# Altium schematic sheet SkyPulseUAV_PowerModule.SchDoc: SkyPulseUAV_Power
size A4; Date: March 2, 2024; Author: Binhan Tian; Revision: V0.2; SheetNumber: 2; SheetTotal: 4
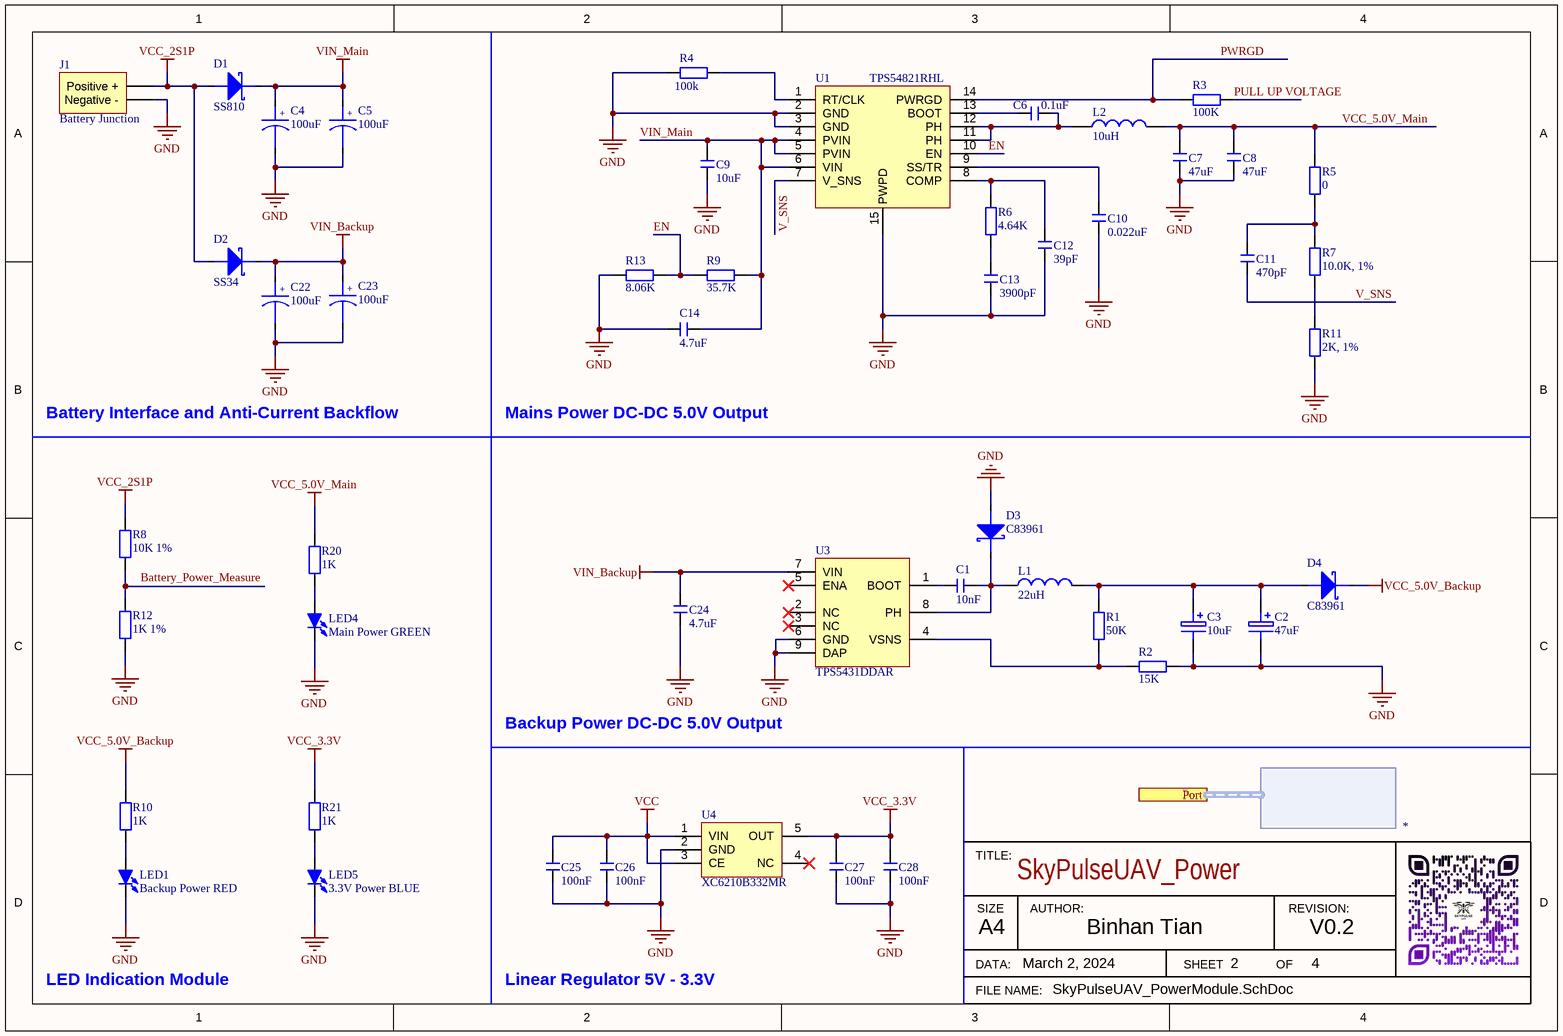
[diagram p0: SkyPulseUAV_PowerModule.SchDoc]

## Parts
C1  10nF  [C 0805_M]
C2  47uF  [CD D(7343)]
C3  10uF  [CD B(3528)]
C4  100uF  [CM D(6.3*7.7)]
C5  100uF  [CM D(6.3*7.7)]
C6  0.1uF  [C 0805_M]
C7  47uF  [C 0805_M]
C8  47uF  [C 0805_M]
C9  10uF  [C 0805_M]
C10  0.022uF  [C 0805_M]
C11  470pF  [C 0805_M]
C12  39pF  [C 0805_M]
C13  3900pF  [C 0805_M]
C14  4.7uF  [C 0805_M]
C22  100uF  [CM D(6.3*7.7)]
C23  100uF  [CM D(6.3*7.7)]
C24  4.7uF  [C 0805_M]
C25  100nF  [C 0603_M]
C26  100nF  [C 0805_M]
C27  100nF  [C 0805_M]
C28  100nF  [C 0805_M]
D1  SS810  [SMB]
D2  SS34  [SMA]
D3  C83961  [SMA]
D4  C83961  [SMA]
J1  Battery Junction
L1  22uH  [CD54]
L2  10uH  [CD54]
LED1  Backup Power RED  [LED 0805R]
LED4  Main Power GREEN  [LED 0805G]
LED5  3.3V Power BLUE  [LED 0805B]
R1  50K  [R 0805_M]
R2  15K  [R 0805_M]
R3  100K  [R 0805_M]
R4  100k  [R 0805_M]
R5  0  [R 0805_M]
R6  4.64K  [R 0805_M]
R7  10.0K, 1%  [R 0805_M]
R8  10K 1%  [R 0805_M]
R9  35.7K  [R 0805_M]
R10  1K  [R 0805_M]
R11  2K, 1%  [R 0805_M]
R12  1K 1%  [R 0805_M]
R13  8.06K  [R 0805_M]
R20  1K  [R 0805_M]
R21  1K  [R 0805_M]
U1  TPS54821RHL
U3  TPS5431DDAR
U4  XC6210B332MR

## Ports
Port (harness *)

## Harnesses
*: 

## Nets
GND: C2.2(E) C3.2(E) C4.2 C5.2 C7.1 C8.1 C9.1 C10.1 C12.1 C13.1 C14.1 C22.2 C23.2 C24.1 C25.1 C26.1 C27.2 C28.2 D3.1 J1.2(Negative_-) LED1.2(K) LED4.2(K) LED5.2(K) R2.1 R4.1 R11.1 R12.1 R13.1 U1.2(GND) U1.3(GND) U1.15(PWPD) U3.6(GND) U3.9(DAP) U4.2(GND)
VCC: C25.2 C26.2 U4.1(VIN) U4.3(CE)
VCC_2S1P: D1.1 D2.1 J1.1(Positive_+) R8.2
VCC_3.3V: C27.1 C28.1 R21.2 U4.5(OUT)
VCC_5.0V_Backup: D4.2 R10.2
VCC_5.0V_Main: C7.2 C8.2 L2.2 R5.2 R20.2
VIN_Backup: C22.1 C23.1 C24.2 D2.2 U3.7(VIN)
VIN_Main: C4.1 C5.1 C9.2 C14.2 D1.2 R9.2 U1.4(PVIN) U1.5(PVIN) U1.6(VIN)
EN: R9.1 R13.2 U1.10(EN)
PULL UP VOLTAGE: R3.2
PWRGD: R3.1 U1.14(PWRGD)
V_SNS: C11.1 U1.7(V_SNS)
NetC1_1: C1.1 U3.1(BOOT)
NetC1_2: C1.2 D3.2 L1.1 U3.8(PH)
NetC2_1: C2.1 C3.1 D4.1 L1.2 R1.2
NetC6_1: C6.1 L2.1 U1.11(PH) U1.12(PH)
NetC6_2: C6.2 U1.13(BOOT)
NetC10_2: C10.2 U1.9(SS/TR)
NetC11_2: C11.2 R5.1 R7.2
NetC12_2: C12.2 R6.2 U1.8(COMP)
NetC13_2: C13.2 R6.1
NetLED1_1: LED1.1(A) R10.1
NetLED4_1: LED4.1(A) R20.1
NetLED5_1: LED5.1(A) R21.1
NetR1_1: R1.1 R2.2 U3.4(VSNS)
NetR4_2: R4.2 U1.1(RT/CLK)
NetR7_1: R7.1 R11.2
NetR8_1: R8.1 R12.2

Not connected (* = marked no-connect by the designer): U3 2(NC)* 3(NC)* 5(ENA)*; U4 4(NC)*

## Notes on the sheet
- Battery Interface and Anti-Current Backflow
- Mains Power DC-DC 5.0V Output
- Backup Power DC-DC 5.0V Output
- LED Indication Module
- Linear Regulator 5V - 3.3V
- Labels drawn without touching a wire or pin: Battery_Power_Measure
- TITLE:
- SIZE
- AUTHOR:
- REVISION:
- DATA:
- FILE NAME:
- A4
- SHEET
- OF
- (in symbol CAP_Electrolytic) +

## Library data of the parts
C1 C6-C14 C24-C28 = CAP: SMD Capacitor
C2 = CAP_TAN: Tantalum capacitor, 47uF, 16V
C3 = CAP_TAN_10uF: Tantalum capacitor, 10uF, 16V, CA45A-B-16V-10uF-K; Model: CA45A-B-16V-10uF-K
C4 C5 C22 C23 = CAP_Electrolytic: SMD Aluminum Electrolytic Capacitors
D1 = SS810: SURFACE MOUNT SCHOTTKY BARRIER RECTIFIER, 8A
D2-D4 = SS34: SURFACE MOUNT SCHOTTKY BARRIER RECTIFIER
J1 = Battery Junction: 7.4V, 2S1P, 38.48Wh, 80C, 5200mAh
L1 L2 = L: Inductance
LED1 LED5 = LED_SMD: SMD LED Red
LED4 = LED: SMD LED Green
R1-R7 R9 R11 R13 = RES: SMD Resistor
R8 R10 R12 R20 R21 = RES: SMD Resistor; BOM名称: 贴片电阻; 版权归属: 源创客; 学习资源: www.ooocke.com
U1 = TPS54821RHL: 4.5 V to 17 V Input, 8 A Synchronous Step Down Converter With Hiccup
U3 = TPS5431DDAR: TPS543x 3A, Wide Input Range, Step-Down Converter
U4 = XC6210B332MR: 800mA, 25uA, Higt PSRR Voltage Regulator